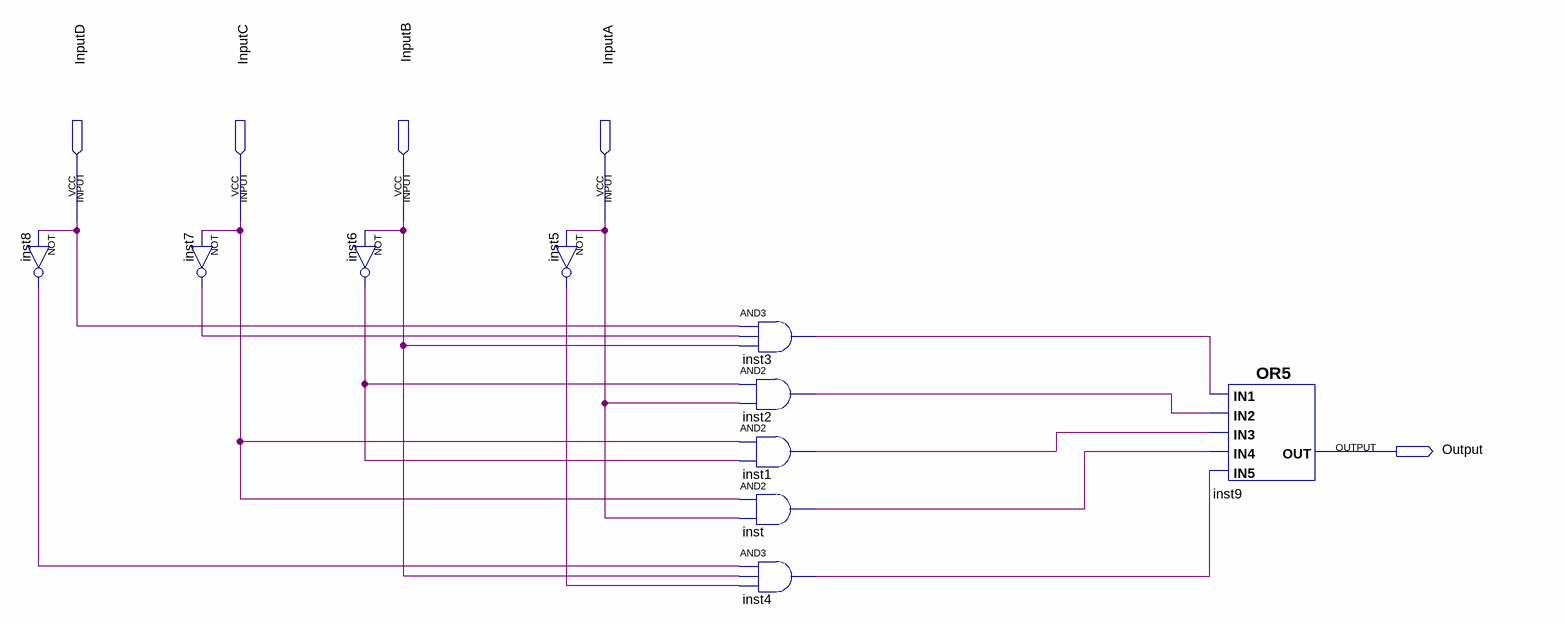
[diagram p0: schematic sheet]
// Quartus schematic SegG.bdf as structural Verilog: 10 symbols, 5 pins
module SegG (
  input  InputD,
  input  InputC,
  input  InputB,
  input  InputA,
  output Output
);

  wire inst1_out, inst2_out, inst3_out, inst4_out, inst5_out, inst6_out, inst7_out, inst8_out, inst_out;

  not inst8 (inst8_out, InputD);
  not inst7 (inst7_out, InputC);
  not inst6 (inst6_out, InputB);
  not inst5 (inst5_out, InputA);
  and inst3 (inst3_out, InputD, inst7_out, InputB);
  and inst2 (inst2_out, inst6_out, InputA);
  and inst1 (inst1_out, InputC, inst6_out);
  and inst (inst_out, InputC, InputA);
  and inst4 (inst4_out, inst8_out, InputB, inst5_out);
  or inst9 (Output, inst3_out, inst2_out, inst1_out, inst_out, inst4_out);
endmodule
